# Altium schematic sheet 4. Outputs.SchDoc
size A4; SheetNumber: 4; SheetTotal: 4
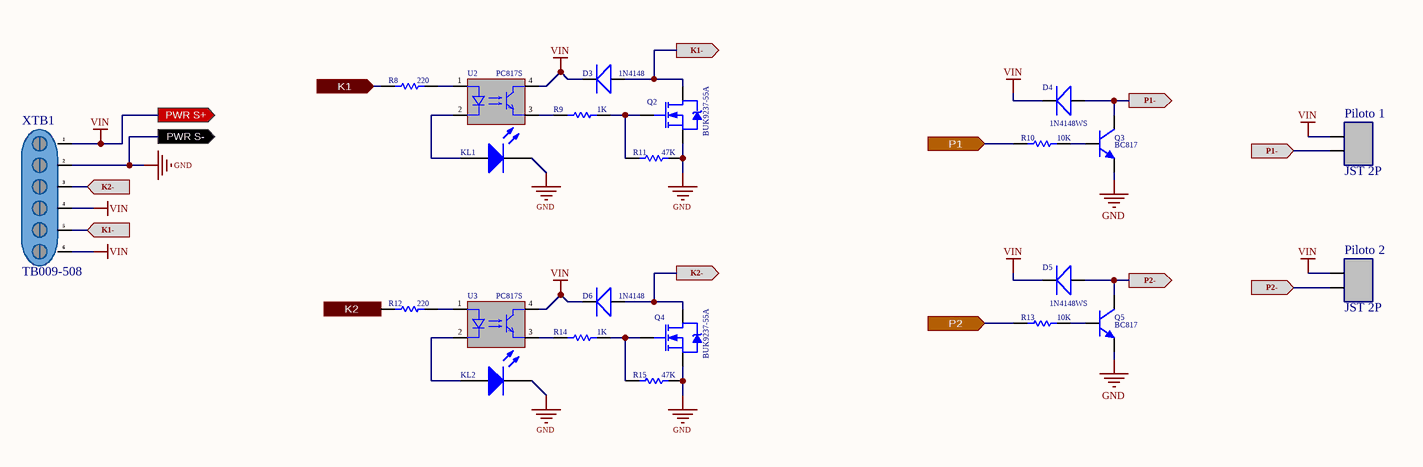
[diagram p0: 4. Outputs.SchDoc]

## Parts
D3  1N4148  [Diodo DO-35]
D4  1N4148WS  [SOD-323]
D5  1N4148WS  [SOD-323]
D6  1N4148  [Diodo DO-35]
KL1  LED 0805  [Led 0805 Y]  (value not drawn)
KL2  LED 0805  [Led 0805 Y]  (value not drawn)
Piloto_1  JST 2P  [JST 2P 2.54mm]
Piloto_2  JST 2P  [JST 2P 2.54mm]
Q2  BUK9237-55A  [DPAK-P]
Q3  BC817  [SOT23127P600-8N]
Q4  BUK9237-55A  [DPAK-P]
Q5  BC817  [SOT23127P600-8N]
R8  220  [Resistencia 0805]
R9  1K  [Resistencia 1206]
R10  10K  [Resistencia 0805]
R11  47K  [Resistencia 1206]
R12  220  [Resistencia 0805]
R13  10K  [Resistencia 0805]
R14  1K  [Resistencia 1206]
R15  47K  [Resistencia 1206]
U2  PC817S  [SOIC 4PIN]
U3  PC817S  [SOIC 4PIN]
XTB1  TB009-508  [T-BLOCK EURO 6P 5.08MM]

## Ports
K1 (in), K1- (in), K1- (out), K2 (in), K2- (in), K2- (out), P1 (in), P1- (in), P1- (out), P2 (in), P2- (in), P2- (out), PWR S+ (out), PWR S- (out)

## Nets
GND: KL1.2(K) KL2.2(K) Q2.3(S) Q3.2(E) Q4.3(S) Q5.2(E) R11.2(B) R15.2(B) XTB1.2 ; port PWR S-
VIN: D3.2(C) D4.2(C) D5.2(C) D6.2(C) Piloto_1.1 Piloto_2.1 U2.4(C) U3.4(C) XTB1.1 XTB1.4 XTB1.6 ; port PWR S+
K1: R8.1(A) ; port K1
K1-: D3.1(A) Q2.2(D) XTB1.5 ; port K1-
K2: R12.1(A) ; port K2
K2-: D6.1(A) Q4.2(D) XTB1.3 ; port K2-
P1: R10.1(A) ; port P1
P1-: D4.1(A) Piloto_1.2 Q3.3(C) ; port P1-
P2: R13.1(A) ; port P2
P2-: D5.1(A) Piloto_2.2 Q5.3(C) ; port P2-
NetKL1_1: KL1.1(A) U2.2(K)
NetKL2_1: KL2.1(A) U3.2(K)
NetQ2_1: Q2.1(G) R9.1(A) R11.1(A)
NetQ3_1: Q3.1(B) R10.2(B)
NetQ4_1: Q4.1(G) R14.1(A) R15.1(A)
NetQ5_1: Q5.1(B) R13.2(B)
NetR8_2: R8.2(B) U2.1(A)
NetR9_2: R9.2(B) U2.3(E)
NetR12_2: R12.2(B) U3.1(A)
NetR14_2: R14.2(B) U3.3(E)

## Library data of the parts
D3 D6 = 1N4148-TH: Diodo Rectificador Recuperacion Rapida TH
D4 D5 = 1N4148WS: Diodo Rectificador Recuperacion Rapida
KL1 KL2 = LED 0805: LED SMD 0805
Piloto_1 Piloto_2 = JST 2P 2.54mm
Q2 Q4 = IRFR3707Z: N-MOSFET DPAK
Q3 Q5 = MBT2222A: BJT SOT23 NPN TRANSISTOR
R8 R10 R12 R13 = Resistencia SMD 0805
R9 R11 R14 R15 = Resistencia SMD 1206
U2 U3 = PC817S: Optoacoplador NPN 4 PIN SMD
XTB1 = T-Block E 5.08mm 6P: Terminal de Bloque 6P 5.08mm High Current Euro Style TB009-508 CUI Devices